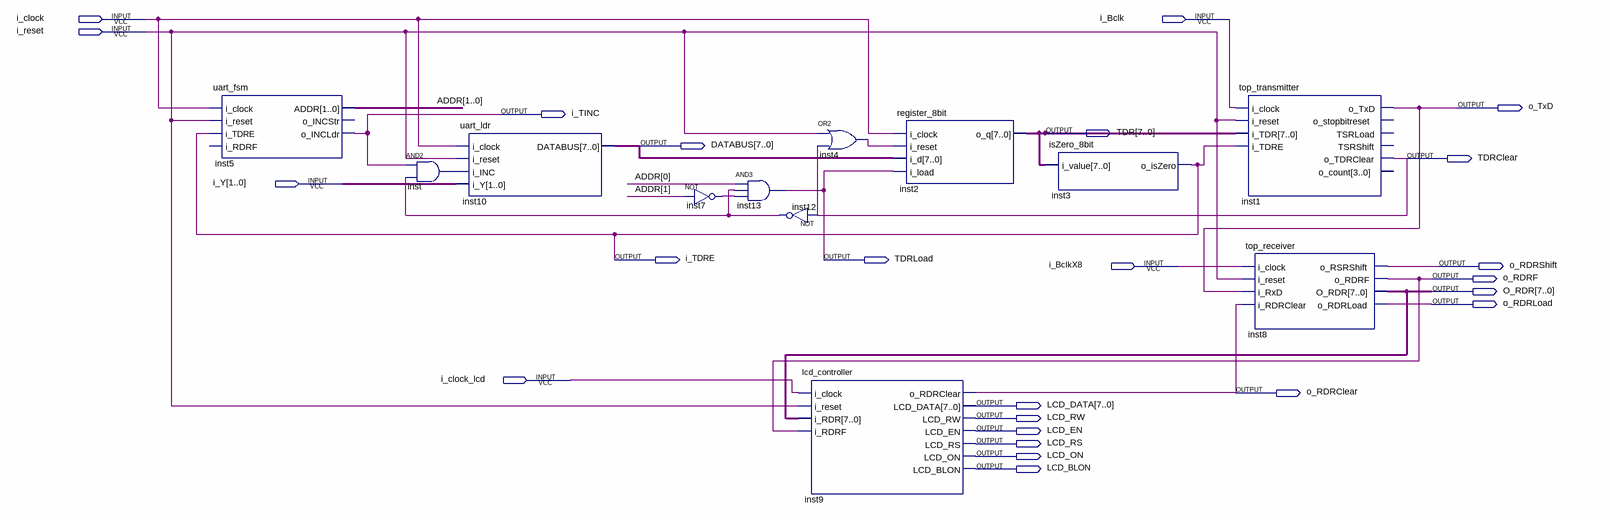
[diagram p0: schematic sheet]
// Quartus schematic UART.bdf as structural Verilog: 12 symbols, 24 pins
module UART (
  input  i_clock,
  input  i_Bclk,
  input  i_reset,
  input  [1:0] i_Y,
  input  i_BclkX8,
  input  i_clock_lcd,
  output o_TxD,
  output i_TINC,
  output [7:0] TDR,
  output [7:0] DATABUS,
  output TDRClear,
  output i_TDRE,
  output TDRLoad,
  output o_RDRShift,
  output o_RDRF,
  output [7:0] O_RDR,
  output o_RDRLoad,
  output o_RDRClear,
  output [7:0] LCD_DATA,
  output LCD_RW,
  output LCD_EN,
  output LCD_RS,
  output LCD_ON,
  output LCD_BLON
);

  wire inst4_out, inst7_out, inst12_out, inst_out;
  wire [1:0] ADDR;

  uart_fsm inst5 (
    .i_clock(i_clock), .i_reset(i_reset), .i_TDRE(i_TDRE), .ADDR(ADDR), .o_INCLdr(i_TINC));  // open: i_RDRF, o_INCStr
  and inst (inst_out, i_TINC, inst12_out);
  uart_ldr inst10 (.i_clock(i_clock), .i_reset(i_reset), .i_INC(inst_out), .i_Y(i_Y), .DATABUS(DATABUS));
  not inst7 (inst7_out, ADDR[1]);
  and inst13 (TDRLoad, ADDR[0], inst12_out, inst7_out);
  or inst4 (inst4_out, i_reset, TDRClear);
  not inst12 (inst12_out, TDRClear);
  lcd_controller inst9 (
    .i_clock(i_clock_lcd), .i_reset(i_reset), .i_RDR(O_RDR), .i_RDRF(o_RDRF), .o_RDRClear(o_RDRClear),
    .LCD_DATA(LCD_DATA), .LCD_RW(LCD_RW), .LCD_EN(LCD_EN), .LCD_RS(LCD_RS), .LCD_ON(LCD_ON),
    .LCD_BLON(LCD_BLON));
  register_8bit inst2 (.i_clock(i_clock), .i_reset(inst4_out), .i_d(DATABUS), .i_load(TDRLoad), .o_q(TDR));
  isZero_8bit inst3 (.i_value(TDR), .o_isZero(i_TDRE));
  top_transmitter inst1 (
    .i_clock(i_Bclk), .i_reset(i_reset), .i_TDR(TDR), .i_TDRE(i_TDRE), .o_TxD(o_TxD), .o_TDRClear(TDRClear));  // open: o_stopbitreset, TSRLoad, TSRShift, o_count
  top_receiver inst8 (
    .i_clock(i_BclkX8), .i_reset(i_reset), .i_RxD(o_TxD), .i_RDRClear(o_RDRClear), .o_RSRShift(o_RDRShift),
    .o_RDRF(o_RDRF), .O_RDR(O_RDR), .o_RDRLoad(o_RDRLoad));
endmodule
